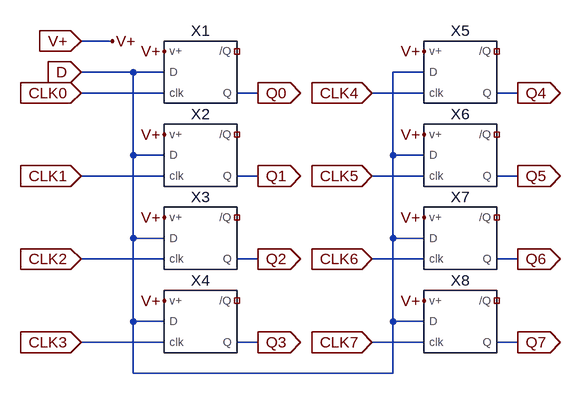
[diagram p0: schematic Octal-D-Latch.asc]
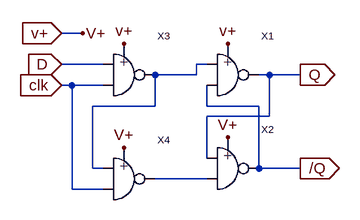
[diagram p1: sub-circuit d-latch.asc]
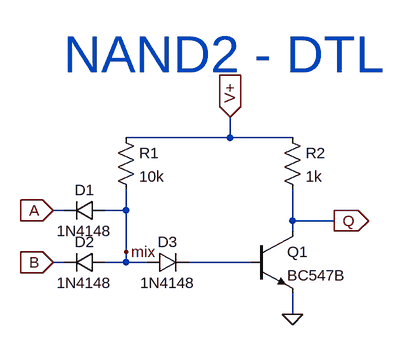
[diagram p2: sub-circuit nand2.asc]
Octal-D-Latch.asc, the LTspice schematic file:
Version 4
SHEET 1 880 680
WIRE -112 64 -160 64
WIRE -80 112 -160 112
WIRE -32 112 -80 112
WIRE 368 112 320 112
WIRE -32 144 -160 144
WIRE 112 144 80 144
WIRE 368 144 288 144
WIRE 512 144 480 144
WIRE -80 240 -80 112
WIRE -32 240 -80 240
WIRE 320 240 320 112
WIRE 368 240 320 240
WIRE -32 272 -160 272
WIRE 112 272 80 272
WIRE 368 272 288 272
WIRE 512 272 480 272
WIRE -80 368 -80 240
WIRE -32 368 -80 368
WIRE 320 368 320 240
WIRE 368 368 320 368
WIRE -32 400 -160 400
WIRE 112 400 80 400
WIRE 368 400 288 400
WIRE 512 400 480 400
WIRE -80 496 -80 368
WIRE -32 496 -80 496
WIRE 320 496 320 368
WIRE 368 496 320 496
WIRE -32 528 -160 528
WIRE 112 528 80 528
WIRE 368 528 288 528
WIRE 512 528 480 528
WIRE -80 576 -80 496
WIRE 320 576 320 496
WIRE 320 576 -80 576
FLAG -32 80 V+
FLAG -32 208 V+
FLAG -32 336 V+
FLAG -32 464 V+
FLAG 368 80 V+
FLAG 368 208 V+
FLAG 368 336 V+
FLAG 368 464 V+
FLAG -160 112 D
IOPIN -160 112 In
FLAG -112 64 V+
FLAG -160 64 V+
IOPIN -160 64 In
FLAG 512 528 Q7
IOPIN 512 528 Out
FLAG 512 400 Q6
IOPIN 512 400 Out
FLAG 512 272 Q5
IOPIN 512 272 Out
FLAG 512 144 Q4
IOPIN 512 144 Out
FLAG 112 144 Q0
IOPIN 112 144 Out
FLAG 112 272 Q1
IOPIN 112 272 Out
FLAG 112 400 Q2
IOPIN 112 400 Out
FLAG 112 528 Q3
IOPIN 112 528 Out
FLAG -160 144 CLK0
IOPIN -160 144 In
FLAG -160 272 CLK1
IOPIN -160 272 In
FLAG -160 400 CLK2
IOPIN -160 400 In
FLAG -160 528 CLK3
IOPIN -160 528 In
FLAG 288 144 CLK4
IOPIN 288 144 In
FLAG 288 272 CLK5
IOPIN 288 272 In
FLAG 288 400 CLK6
IOPIN 288 400 In
FLAG 288 528 CLK7
IOPIN 288 528 In
SYMBOL D-LATCH 16 128 R0
SYMATTR InstName X1
SYMBOL D-LATCH 16 256 R0
SYMATTR InstName X2
SYMBOL D-LATCH 16 384 R0
SYMATTR InstName X3
SYMBOL D-LATCH 16 512 R0
SYMATTR InstName X4
SYMBOL D-LATCH 416 128 R0
SYMATTR InstName X5
SYMBOL D-LATCH 416 256 R0
SYMATTR InstName X6
SYMBOL D-LATCH 416 384 R0
SYMATTR InstName X7
SYMBOL D-LATCH 416 512 R0
SYMATTR InstName X8

d-latch.asc, the sub-circuit schematic file:
Version 4
SHEET 1 880 680
WIRE 128 176 96 176
WIRE 160 224 96 224
WIRE 320 224 304 224
WIRE 304 240 304 224
WIRE 304 240 240 240
WIRE 416 240 400 240
WIRE 464 240 416 240
WIRE 112 256 96 256
WIRE 160 256 112 256
WIRE 240 288 240 240
WIRE 240 288 144 288
WIRE 320 288 320 256
WIRE 400 288 320 288
WIRE 416 304 416 240
WIRE 416 304 320 304
WIRE 320 368 320 304
WIRE 144 384 144 288
WIRE 160 384 144 384
WIRE 400 384 400 288
WIRE 464 384 400 384
WIRE 320 400 240 400
WIRE 112 416 112 256
WIRE 160 416 112 416
FLAG 352 192 v+
FLAG 96 176 v+
IOPIN 96 176 In
FLAG 192 192 v+
FLAG 464 384 /Q
IOPIN 464 384 Out
FLAG 464 240 Q
IOPIN 464 240 Out
FLAG 96 224 D
IOPIN 96 224 In
FLAG 96 256 clk
IOPIN 96 256 In
FLAG 128 176 V+
FLAG 192 352 V+
FLAG 352 336 V+
SYMBOL NAND2 352 240 R0
SYMATTR InstName X1
SYMBOL NAND2 352 384 R0
SYMATTR InstName X2
SYMBOL NAND2 192 240 R0
SYMATTR InstName X3
SYMBOL NAND2 192 400 R0
SYMATTR InstName X4

nand2.asc, the sub-circuit schematic file:
Version 4
SHEET 1 880 680
WIRE 288 -48 288 -80
WIRE 288 -48 128 -48
WIRE 384 -48 288 -48
WIRE 32 64 16 64
WIRE 128 64 128 32
WIRE 128 64 96 64
WIRE 384 80 384 32
WIRE 448 80 384 80
WIRE 384 96 384 80
WIRE 128 128 128 64
WIRE 32 144 16 144
WIRE 128 144 128 128
WIRE 128 144 96 144
WIRE 160 144 128 144
WIRE 320 144 224 144
WIRE 384 224 384 192
FLAG 384 224 0
FLAG 448 80 Q
IOPIN 448 80 Out
FLAG 16 64 A
IOPIN 16 64 In
FLAG 16 144 B
IOPIN 16 144 In
FLAG 288 -80 V+
IOPIN 288 -80 In
FLAG 128 128 mix
SYMBOL diode 96 48 R90
WINDOW 0 0 32 VBottom 2
WINDOW 3 32 32 VTop 2
SYMATTR InstName D1
SYMATTR Value 1N4148
SYMBOL res 112 -64 R0
SYMATTR InstName R1
SYMATTR Value 10k
SYMBOL npn 320 96 R0
SYMATTR InstName Q1
SYMATTR Value BC547B
SYMBOL res 368 -64 R0
SYMATTR InstName R2
SYMATTR Value 1k
SYMBOL diode 96 128 R90
WINDOW 0 0 32 VBottom 2
WINDOW 3 32 32 VTop 2
SYMATTR InstName D2
SYMATTR Value 1N4148
SYMBOL diode 160 160 R270
WINDOW 0 32 32 VTop 2
WINDOW 3 0 32 VBottom 2
SYMATTR InstName D3
SYMATTR Value 1N4148
TEXT 32 -176 Left 6 ;NAND2 - DTL

The netlist it stands for:
* Octal-D-Latch.asc
XX1 CLK0 D V+ NC_01 Q0 d-latch
XX2 CLK1 D V+ NC_02 Q1 d-latch
XX3 CLK2 D V+ NC_03 Q2 d-latch
XX4 CLK3 D V+ NC_04 Q3 d-latch
XX5 CLK4 D V+ NC_05 Q4 d-latch
XX6 CLK5 D V+ NC_06 Q5 d-latch
XX7 CLK6 D V+ NC_07 Q6 d-latch
XX8 CLK7 D V+ NC_08 Q7 d-latch

* block symbol definitions
.subckt d-latch clk D v+ /Q Q
XX1 N001 /Q Q v+ nand2
XX2 Q N002 /Q v+ nand2
XX3 D clk N001 v+ nand2
XX4 N001 clk N002 v+ nand2
.ends d-latch

.subckt nand2 A B Q V+
D1 mix A 1N4148
R1 V+ mix 10k
Q1 Q N001 0 0 BC547B
R2 V+ Q 1k
D2 mix B 1N4148
D3 mix N001 1N4148
* NAND2 - DTL
.ends nand2

.model D D
.lib standard.dio
.model NPN NPN
.model PNP PNP
.lib standard.bjt
.backanno
.end